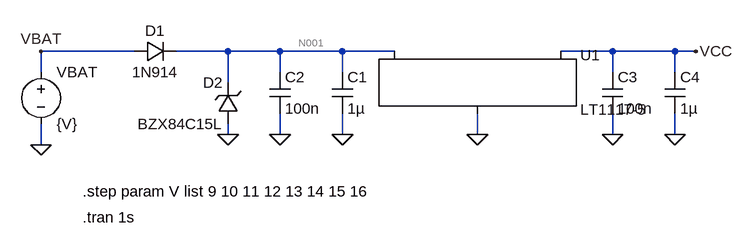
[diagram p0: schematic Regulador.asc]
Regulador.asc, the LTspice schematic file:
Version 4
SHEET 1 976 680
WIRE 48 -48 -96 -48
WIRE 192 -48 112 -48
WIRE 272 -48 192 -48
WIRE 368 -48 272 -48
WIRE 448 -48 368 -48
WIRE 784 -48 704 -48
WIRE 880 -48 784 -48
WIRE 912 -48 880 -48
WIRE -96 -16 -96 -48
WIRE 272 -16 272 -48
WIRE 368 -16 368 -48
WIRE 784 -16 784 -48
WIRE 880 -16 880 -48
WIRE 192 0 192 -48
WIRE 192 80 192 64
WIRE 272 80 272 48
WIRE 368 80 368 48
WIRE 576 80 576 48
WIRE 784 80 784 48
WIRE 880 80 880 48
WIRE -96 96 -96 64
FLAG -96 96 0
FLAG 880 80 0
FLAG 784 80 0
FLAG 368 80 0
FLAG 272 80 0
FLAG 192 80 0
FLAG 912 -48 VCC
FLAG -96 -48 VBAT
FLAG 576 80 0
SYMBOL voltage -96 -32 R0
SYMATTR InstName VBAT
SYMATTR Value {V}
SYMBOL cap 352 -16 R0
SYMATTR InstName C1
SYMATTR Value 1µ
SYMBOL cap 256 -16 R0
SYMATTR InstName C2
SYMATTR Value 100n
SYMBOL cap 768 -16 R0
SYMATTR InstName C3
SYMATTR Value 100n
SYMBOL cap 864 -16 R0
SYMATTR InstName C4
SYMATTR Value 1µ
SYMBOL diode 48 -32 R270
WINDOW 0 32 32 VTop 2
WINDOW 3 0 32 VBottom 2
SYMATTR InstName D1
SYMATTR Value 1N914
SYMBOL zener 208 64 R180
WINDOW 0 24 64 Left 2
WINDOW 3 24 0 Left 2
SYMATTR InstName D2
SYMATTR Value BZX84C15L
SYMATTR Description Diode
SYMATTR Type diode
SYMBOL PowerProducts\\LT1117-5 576 -48 R0
SYMATTR InstName U1
TEXT -32 168 Left 2 !.step param V list 9 10 11 12 13 14 15 16
TEXT -32 208 Left 2 !.tran 1s

The netlist it stands for:
* Regulador.asc
VBAT VBAT 0 {V}
C1 N001 0 1µ
C2 N001 0 100n
C3 VCC 0 100n
C4 VCC 0 1µ
D1 VBAT N001 1N914
D2 0 N001 BZX84C15L
XU1 0 VCC N001 LT1117-5
.model D D
.lib standard.dio
.step param V list 9 10 11 12 13 14 15 16
.tran 1s
.backanno
.end

* Results of the author's LTspice run, read from the files saved beside the schematic
* Operating Point (first step), zero values left out:
*   v = 9 
*   V(vbat) = -9 V
*   V(n001) = -27.14 µV
*   V(vcc) = -1.858 µV
*   I(D1) = -2.529 nA
*   I(Vbat) = -2.529 nA
*   Ix(u1:1) = 2.528 nA
*   Ix(u1:3) = -2.528 nA
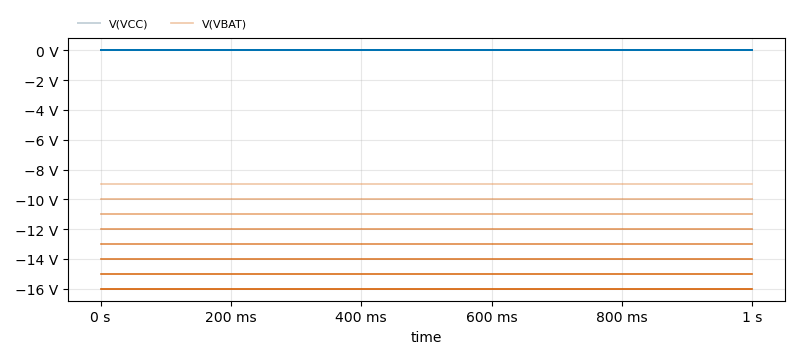
[diagram p1: Transient Analysis of Regulador.asc, plotted from the saved traces]
* Transient Analysis, 8 runs:
*   V(VCC) [v=9]: min -1.858 µV, max -1.858 µV, average -1.858 µV, rms 1.858 µV, last -1.858 µV
*   V(VCC) [v=10]: min -1.859 µV, max -1.859 µV, average -1.859 µV, rms 1.859 µV, last -1.859 µV
*   V(VCC) [v=11]: min -1.86 µV, max -1.86 µV, average -1.86 µV, rms 1.86 µV, last -1.86 µV
*   V(VCC) [v=12]: min -1.861 µV, max -1.861 µV, average -1.861 µV, rms 1.861 µV, last -1.861 µV
*   V(VCC) [v=13]: min -1.861 µV, max -1.861 µV, average -1.861 µV, rms 1.861 µV, last -1.861 µV
*   V(VCC) [v=14]: min -1.862 µV, max -1.862 µV, average -1.862 µV, rms 1.862 µV, last -1.862 µV
*   V(VCC) [v=15]: min -1.863 µV, max -1.863 µV, average -1.863 µV, rms 1.863 µV, last -1.863 µV
*   V(VCC) [v=16]: min -1.864 µV, max -1.864 µV, average -1.864 µV, rms 1.864 µV, last -1.864 µV
*   V(VBAT) [v=9]: min -9 V, max -9 V, average -9 V, rms 9 V, last -9 V
*   V(VBAT) [v=10]: min -10 V, max -10 V, average -10 V, rms 10 V, last -10 V
*   V(VBAT) [v=11]: min -11 V, max -11 V, average -11 V, rms 11 V, last -11 V
*   V(VBAT) [v=12]: min -12 V, max -12 V, average -12 V, rms 12 V, last -12 V
*   V(VBAT) [v=13]: min -13 V, max -13 V, average -13 V, rms 13 V, last -13 V
*   V(VBAT) [v=14]: min -14 V, max -14 V, average -14 V, rms 14 V, last -14 V
*   V(VBAT) [v=15]: min -15 V, max -15 V, average -15 V, rms 15 V, last -15 V
*   V(VBAT) [v=16]: min -16 V, max -16 V, average -16 V, rms 16 V, last -16 V